# Altium project QuadCopter.PrjPCB
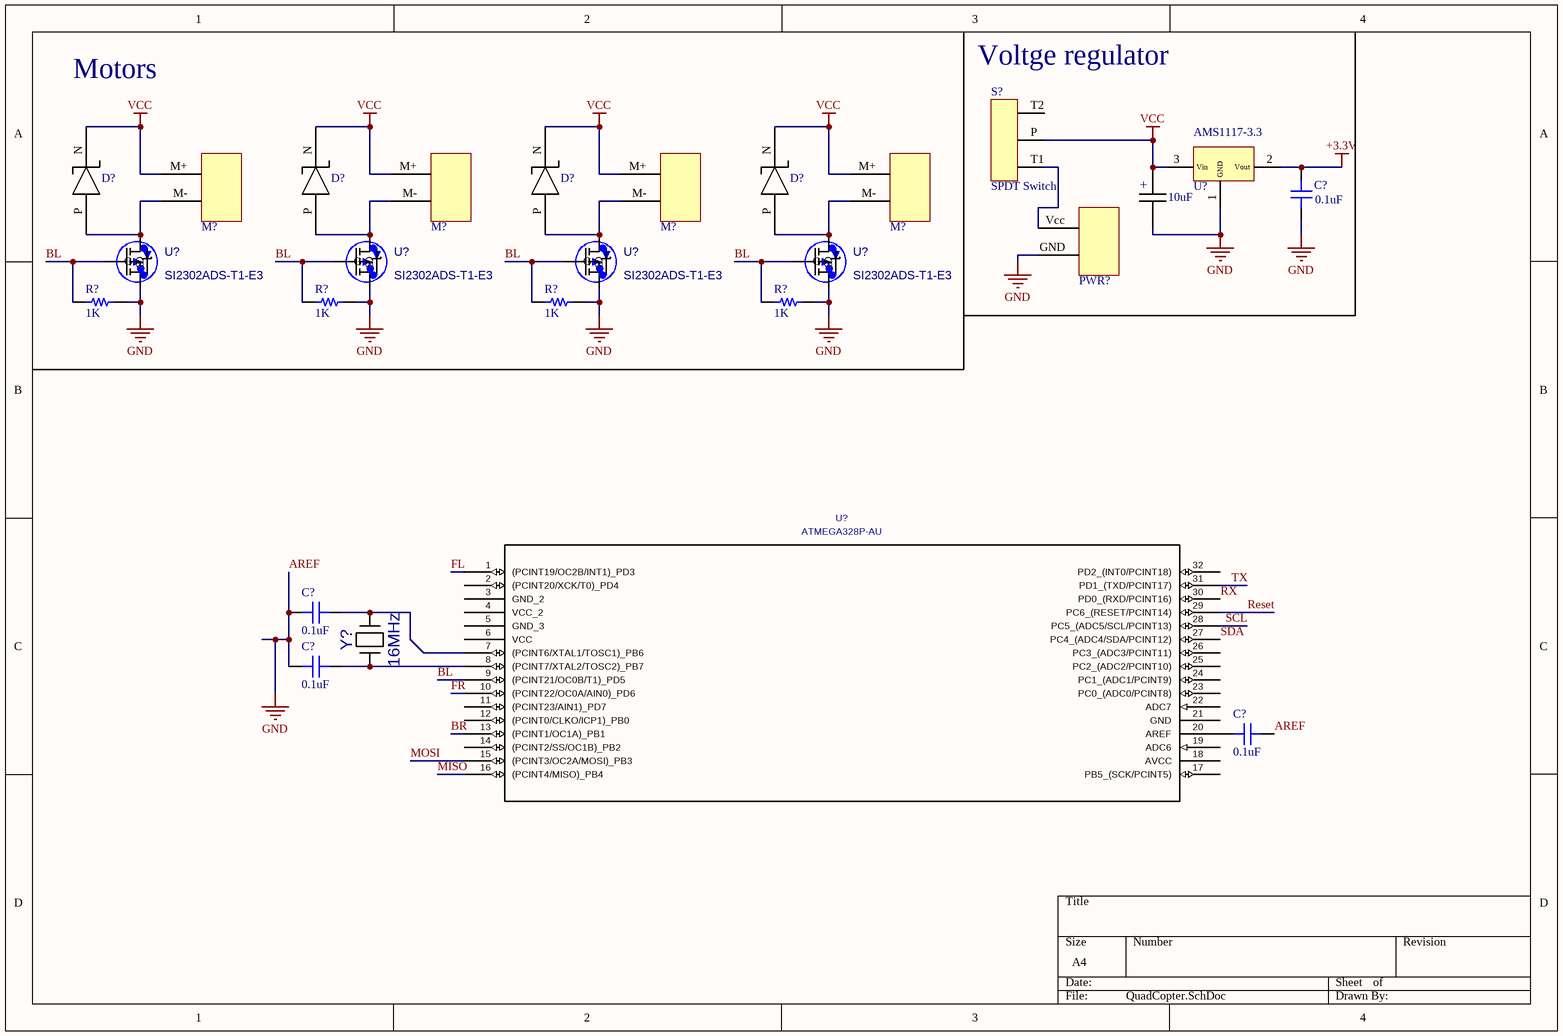
[diagram p0: QuadCopter.SchDoc]
1 sheet, 26 parts. Net scope: global (net labels, ports and power ports of the same name join across sheets).
Board file: QuadCopter.PcbDoc

## Sheet QuadCopter.SchDoc
size A4

### Parts
(Parts that share a designator on the sheet are numbered #1, #2 ... from top to bottom, then left to right.)
10uF  Electrolytic capacitor  [10uF Electrolytic Capacitor]  (value not drawn)
C?#1  0.1uF  [CAP 0805/2012]
C?#2  0.1uF  [CAP 0805/2012]
C?#3  0.1uF  [CAP 0805/2012]
C?#4  0.1uF  [CAP 0805/2012]
D?#1  Surface Mount Schottky Barrier Rectifier  [SS12]  (value not drawn)
D?#2  Surface Mount Schottky Barrier Rectifier  [SS12]  (value not drawn)
D?#3  Surface Mount Schottky Barrier Rectifier  [SS12]  (value not drawn)
D?#4  Surface Mount Schottky Barrier Rectifier  [SS12]  (value not drawn)
M?#1  Motor_Connector  [Motor_Connector]  (value not drawn)
M?#2  Motor_Connector  [Motor_Connector]  (value not drawn)
M?#3  Motor_Connector  [Motor_Connector]  (value not drawn)
M?#4  Motor_Connector  [Motor_Connector]  (value not drawn)
PWR?  Power connector  [Power Connector]  (value not drawn)
R?#1  1K  [RES 0805/2012]
R?#2  1K  [RES 0805/2012]
R?#3  1K  [RES 0805/2012]
R?#4  1K  [RES 0805/2012]
S?  SPDT Switch  [SPDT switch]
U?#1  AMS1117-3.3  [AMS1117-3.3]
U?#2  SI2302ADS-T1-E3  [TO-236-L]
U?#3  SI2302ADS-T1-E3  [TO-236-L]
U?#4  SI2302ADS-T1-E3  [TO-236-L]
U?#5  SI2302ADS-T1-E3  [TO-236-L]
U?#6  ATMEGA328P-AU  [32A]
Y?  value 16MHz  [16MHzCrystal]  (hidden comment: ABLS-16MHZ-CL-RE)

### Nets
+3.3V: C?#1.2 U?#1.2(Vout)
AREF: 10uF.-Ve C?#1.1 C?#2.1 C?#3.1 C?#4.2 PWR?.GND R?#1.2 R?#2.2 R?#3.2 R?#4.2 U?#1.1(GND) U?#2.2(S) U?#3.2(S) U?#4.2(S) U?#5.2(S)  [also labelled GND]
VCC: 10uF.+ve(+Ve) D?#1.N D?#2.N D?#3.N D?#4.N M?#1.M+ M?#2.M+ M?#3.M+ M?#4.M+ S?.P U?#1.3(Vin)
BL: R?#1.1 R?#2.1 R?#3.1 R?#4.1 U?#2.1(G) U?#3.1(G) U?#4.1(G) U?#5.1(G) U?#6.9((PCINT21/OC0B/T1)_PD5)
BR: U?#6.13((PCINT1/OC1A)_PB1)
FL: U?#6.1((PCINT19/OC2B/INT1)_PD3)
FR: U?#6.10((PCINT22/OC0A/AIN0)_PD6)
MISO: U?#6.16((PCINT4/MISO)_PB4)
MOSI: U?#6.15((PCINT3/OC2A/MOSI)_PB3)
Reset: U?#6.29(PC6_(RESET/PCINT14))
RX: U?#6.30(PD0_(RXD/PCINT16))
SCL: U?#6.28(PC5_(ADC5/SCL/PCINT13))
SDA: U?#6.27(PC4_(ADC4/SDA/PCINT12))
TX: U?#6.31(PD1_(TXD/PCINT17))
NetC?#2_2: C?#2.2 U?#6.7((PCINT6/XTAL1/TOSC1)_PB6) Y?.2
NetC?#3_2: C?#3.2 U?#6.8((PCINT7/XTAL2/TOSC2)_PB7) Y?.1
NetC?#4_1: C?#4.1 U?#6.20(AREF)
NetD?#1_P: D?#1.P M?#1.M- U?#2.3(D)
NetD?#2_P: D?#2.P M?#2.M- U?#3.3(D)
NetD?#3_P: D?#3.P M?#3.M- U?#4.3(D)
NetD?#4_P: D?#4.P M?#4.M- U?#5.3(D)
NetPWR?_Vcc: PWR?.Vcc S?.T1

Not connected (* = marked no-connect by the designer): S? T2; U?#6 2((PCINT20/XCK/T0)_PD4) 3(GND_2) 4(VCC_2) 5(GND_3) 6(VCC) 11((PCINT23/AIN1)_PD7) 12((PCINT0/CLKO/ICP1)_PB0) 14((PCINT2/SS/OC1B)_PB2) 17(PB5_(SCK/PCINT5)) 18(AVCC) 19(ADC6) 21(GND) 22(ADC7) 23(PC0_(ADC0/PCINT8)) 24(PC1_(ADC1/PCINT9)) 25(PC2_(ADC2/PCINT10)) 26(PC3_(ADC3/PCINT11)) 32(PD2_(INT0/PCINT18))

### Notes on the sheet
- Motors
- (near S?) Voltge regulator
- (in symbol Electrolytic capacitor) +

### Library data of the parts
C?#1-C?#4 = Capacitor: SMT Capacitor; Value: 0.1uF
D?#1-D?#4 = SS12
R?#1-R?#4 = Resistor: SMT Resistor; Value: 1K
U?#2-U?#5 = SI2302ADS-T1-E3: C: Copyright (C) 2015 Accelerated Designs. All rights reserved; Vendor: Vishay; Built_By: EMA_UL_Team; Manufacturer_Part_Number: SI2302ADS-T1-E3; Value: SI2302ADS-T1-E3
U?#6 = ATMEGA328P-AU: C: Copyright (C) 2015 Accelerated Designs. All rights reserved; Vendor: Atmel; Built_By: EMA_UL_Team; Value: ATMEGA328P-AU; Manufacturer_Part_Number: ATMEGA328P-AU
Y? = Crystal: Manufacturer_Part_Number: ABLS-16MHZ-CL-RESR-A-1-G-F; C: Copyright (C) 2015 Accelerated Designs. All rights reserved; Vendor: Abracon; Built_By: EMA_UL_Team